# EAGLE schematic 2021-02-22_22-45-18 (EAGLE 9.6.2)
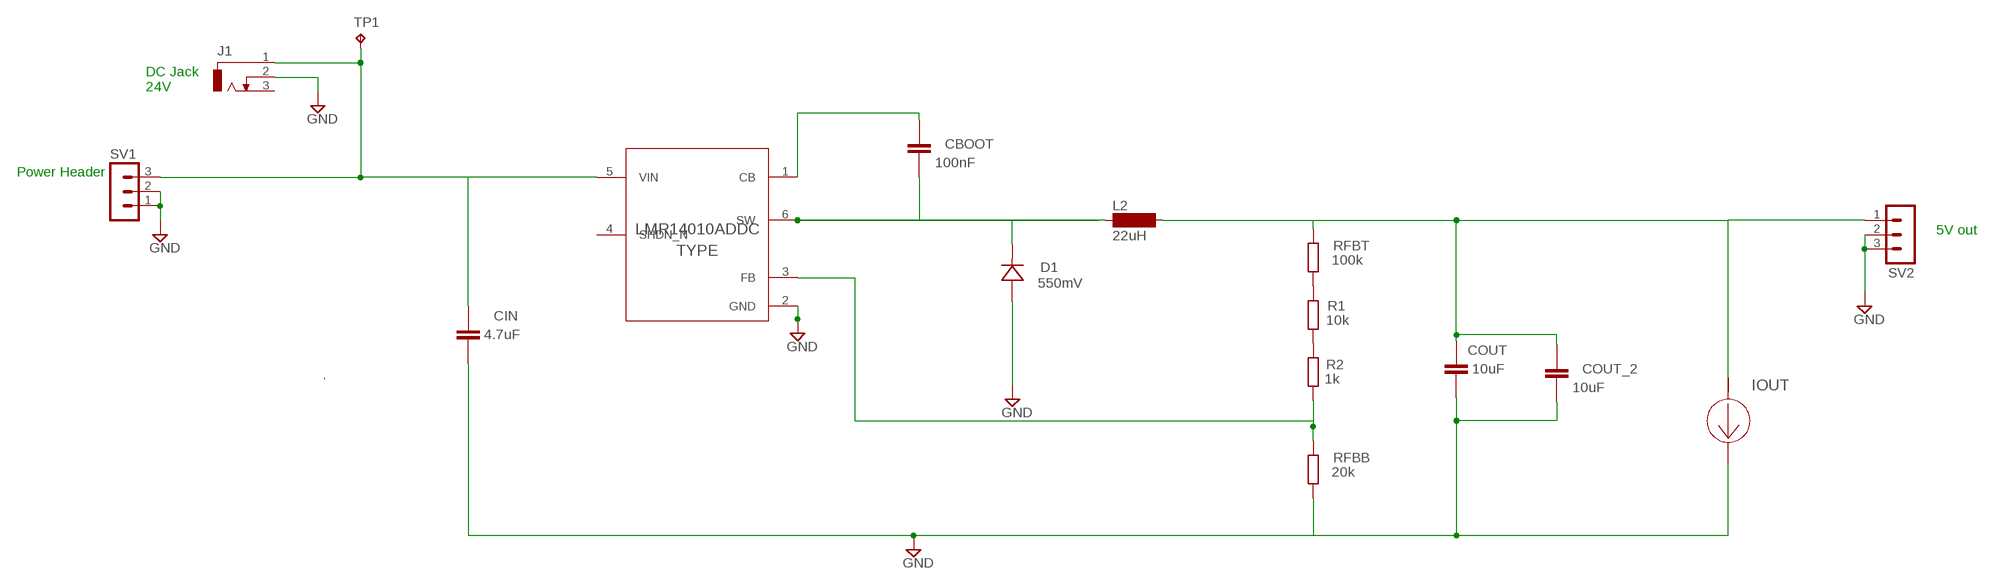
[diagram p0: schematic, sheet 1]

## Parts
CBOOT  100nF  CAPACITOR-0603  [C0603]
CIN  4.7uF  CAPACITOR-0603  [C0603]
COUT  10uF  CAPACITOR-0603  [C0603]
COUT_2  10uF  CAPACITOR-0603  [C0603]
D1  550mV  DIODE-DFN0603-2  [DFN0603-2]
IOUT  WB_CURRENT_LOAD  WB_CURRENT_LOADWB_CURRENT_LOAD  [WB_CURRENT_LOAD]
J1  DCJ0303  [DCJ0303]
L2  22uH  SD8  [SD8]
LMR14010ADDC  LMR14010ADDCR  LMR14010ADDCRLMR14010ADDCR  [DDC0006A_N]
R1  10k  RESISTOR-0603  [R0603]
R2  1k  RESISTOR-0603  [R0603]
RFBB  20k  RESISTOR-0603  [R0603]
RFBT  100k  RESISTOR-0603  [R0603]
SV1  MA03-1  [MA03-1]
SV2  MA03-1  [MA03-1]
TP1  TPPAD1-13  [P1-13]

## Nets
1: CBOOT.2 LMR14010ADDC.1(CB)
2: LMR14010ADDC.3(FB) R2.1 RFBB.2
4: RFBB.1
5: COUT.2 COUT_2.2 IOUT.1(+) L2.2 RFBT.2 SV2.1
6: CBOOT.1 D1.C
GND: CIN.1 COUT.1 COUT_2.1 D1.A IOUT.2(-) J1.2 LMR14010ADDC.2(GND) SV1.1 SV1.2 SV2.2 SV2.3
N$1: CIN.2 J1.1 LMR14010ADDC.5(VIN) SV1.3 TP1.TP
N$2: L2.1 LMR14010ADDC.6(SW)
N$4: R1.2 RFBT.1
N$5: R1.1 R2.2
Unconnected: J1.3 LMR14010ADDC.4(SHDN_N)

## Notes on the sheet
- DC Jack
  24V
- Power Header
- 5V out

## Library data of the parts
CBOOT CIN COUT COUT_2 = Components:CAPACITOR
D1 = Components:DIODE: Standard 1N4148 diode
IOUT = AcceleratedDesigns_Lib:WB_CURRENT_LOAD; MANUFACTURER_NAME: WB_CURRENT_LOAD; MANUFACTURER_PART_NUMBER: WB_CURRENT_LOAD; POWERPORTTYPE: POWER_GROUND; VALUE: Value
J1 = con-jack:DCJ0303: DC POWER JACK Source: DCJ0303.pdf; OC_FARNELL: unknown; OC_NEWARK: unknown
L2 = inductor-neosid:SD8: INDUCTOR nominal inductance; OC_FARNELL: unknown; OC_NEWARK: unknown
LMR14010ADDC = AcceleratedDesigns_Lib:LMR14010ADDCR; MANUFACTURER: Texas Instruments; MANUFACTURER_NAME: Texas Instruments; MANUFACTURER_PART_NUMBER: LMR14010ADDCR; PARTNUMBER: LMR14010ADDCR; REFDES: RefDes; TYPE: TYPE; VALUE: Value
R1 R2 RFBB RFBT = Components:RESISTOR
SV1 SV2 = con-lstb:MA03-1: PIN HEADER; OC_FARNELL: unknown; OC_NEWARK: unknown
TP1 = testpad:TP: Test pad